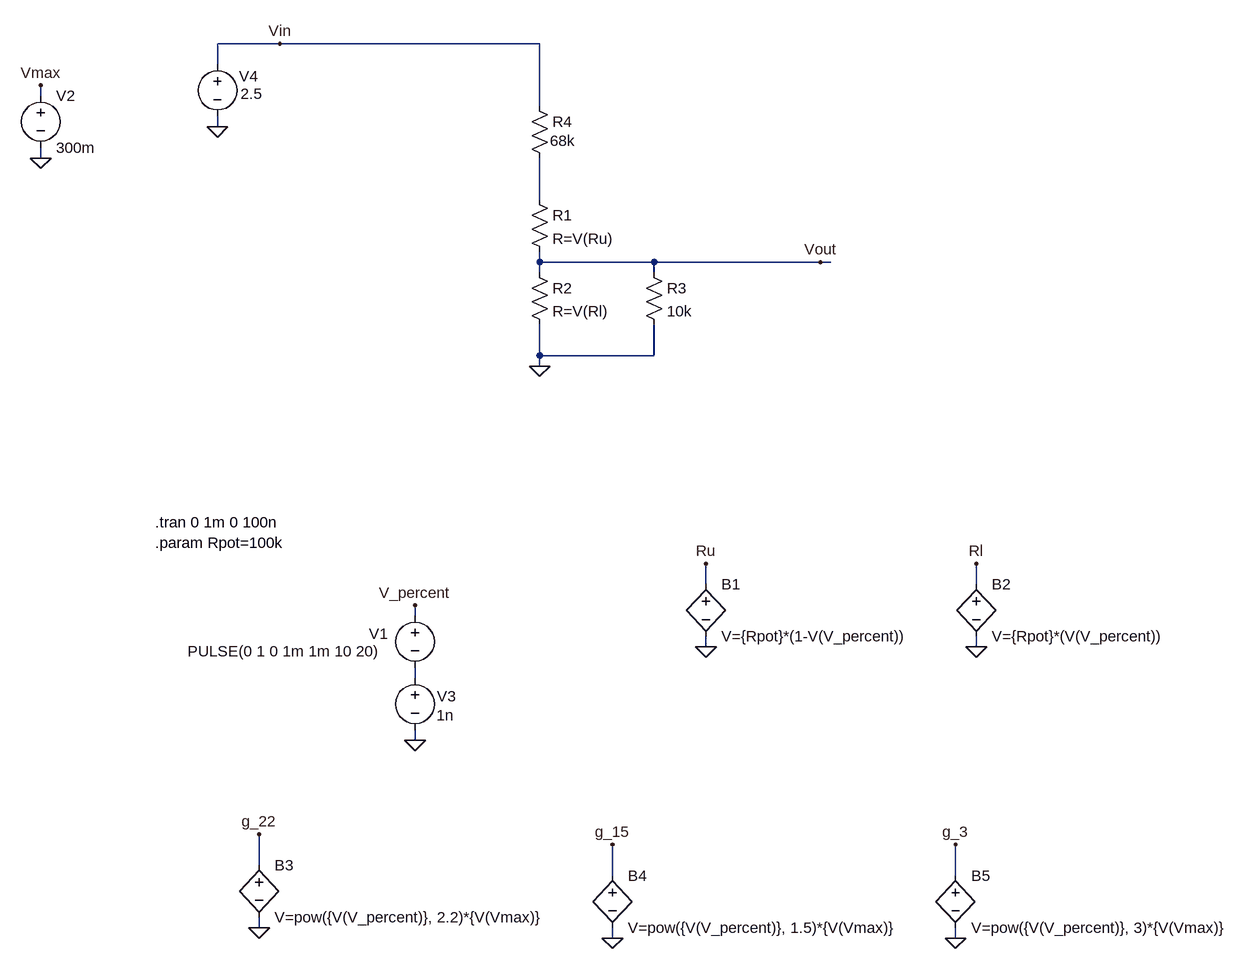
[diagram p0: schematic gammaCorrection3.asc]
gammaCorrection3.asc, the LTspice schematic file:
Version 4
SHEET 1 1748 692
WIRE -496 -720 -592 -720
WIRE -96 -720 -496 -720
WIRE -592 -688 -592 -720
WIRE -864 -640 -864 -656
WIRE -96 -624 -96 -720
WIRE -592 -592 -592 -608
WIRE -864 -544 -864 -560
WIRE -96 -480 -96 -544
WIRE -96 -384 -96 -400
WIRE 80 -384 -96 -384
WIRE 336 -384 80 -384
WIRE 352 -384 336 -384
WIRE -96 -368 -96 -384
WIRE 80 -368 80 -384
WIRE -96 -240 -96 -288
WIRE 80 -240 80 -288
WIRE 80 -240 -96 -240
WIRE -96 -224 -96 -240
WIRE 160 112 160 80
WIRE 576 112 576 80
WIRE -288 160 -288 144
WIRE 160 208 160 192
WIRE 576 208 576 192
WIRE -288 256 -288 240
WIRE -288 352 -288 336
WIRE -528 544 -528 496
WIRE 16 560 16 512
WIRE 544 560 544 512
WIRE -528 640 -528 624
WIRE 16 656 16 640
WIRE 544 656 544 640
FLAG -288 352 0
FLAG -288 144 V_percent
FLAG 160 208 0
FLAG 160 80 Ru
FLAG 576 208 0
FLAG 576 80 Rl
FLAG 336 -384 Vout
FLAG -496 -720 Vin
FLAG -96 -224 0
FLAG -528 640 0
FLAG -528 496 g_22
FLAG 16 656 0
FLAG 16 512 g_15
FLAG 544 656 0
FLAG 544 512 g_3
FLAG -592 -592 0
FLAG -864 -656 Vmax
FLAG -864 -544 0
SYMBOL voltage -288 144 R0
WINDOW 0 -71 44 Left 2
WINDOW 3 -350 71 Left 2
WINDOW 123 0 0 Left 0
WINDOW 39 0 0 Left 0
SYMATTR InstName V1
SYMATTR Value PULSE(0 1 0 1m 1m 10 20)
SYMBOL res -112 -496 R0
SYMATTR InstName R1
SYMATTR Value R=V(Ru)
SYMBOL res -112 -384 R0
SYMATTR InstName R2
SYMATTR Value R=V(Rl)
SYMBOL bv 160 96 R0
SYMATTR InstName B1
SYMATTR Value V={Rpot}*(1-V(V_percent))
SYMBOL bv 576 96 R0
SYMATTR InstName B2
SYMATTR Value V={Rpot}*(V(V_percent))
SYMBOL res 64 -384 R0
SYMATTR InstName R3
SYMATTR Value 10k
SYMBOL voltage -288 240 R0
WINDOW 0 34 44 Left 2
WINDOW 3 33 73 Left 2
WINDOW 123 0 0 Left 0
WINDOW 39 0 0 Left 0
SYMATTR InstName V3
SYMATTR Value 1n
SYMBOL bv -528 528 R0
SYMATTR InstName B3
SYMATTR Value V=pow({V(V_percent)}, 2.2)*{V(Vmax)}
SYMBOL bv 16 544 R0
SYMATTR InstName B4
SYMATTR Value V=pow({V(V_percent)}, 1.5)*{V(Vmax)}
SYMBOL bv 544 544 R0
SYMATTR InstName B5
SYMATTR Value V=pow({V(V_percent)}, 3)*{V(Vmax)}
SYMBOL voltage -592 -704 R0
WINDOW 0 33 34 Left 2
WINDOW 3 36 61 Left 2
WINDOW 123 0 0 Left 0
WINDOW 39 0 0 Left 0
SYMATTR InstName V4
SYMATTR Value 2.5
SYMBOL res -112 -640 R0
WINDOW 3 32 69 Left 2
SYMATTR Value 68k
SYMATTR InstName R4
SYMBOL voltage -864 -656 R0
WINDOW 123 0 0 Left 0
WINDOW 39 0 0 Left 0
SYMATTR InstName V2
SYMATTR Value 300m
TEXT -688 48 Left 2 !.param Rpot=100k
TEXT -688 16 Left 2 !.tran 0 1m 0 100n

The netlist it stands for:
* gammaCorrection3.asc
V1 V_percent N002 PULSE(0 1 0 1m 1m 10 20)
R1 N001 Vout R=V(Ru)
R2 Vout 0 R=V(Rl)
B1 Ru 0 V={Rpot}*(1-V(V_percent))
B2 Rl 0 V={Rpot}*(V(V_percent))
R3 Vout 0 10k
V3 N002 0 1n
B3 g_22 0 V=pow({V(V_percent)}, 2.2)*{V(Vmax)}
B4 g_15 0 V=pow({V(V_percent)}, 1.5)*{V(Vmax)}
B5 g_3 0 V=pow({V(V_percent)}, 3)*{V(Vmax)}
V4 Vin 0 2.5
R4 Vin N001 68k
V2 Vmax 0 300m
.param Rpot=100k
.tran 0 1m 0 100n
.backanno
.end